# EAGLE schematic ECE319K_Baseline_Schematic (EAGLE 9.6.2)
Spring 2022 EE319K/EE319H This is the baseline schematic
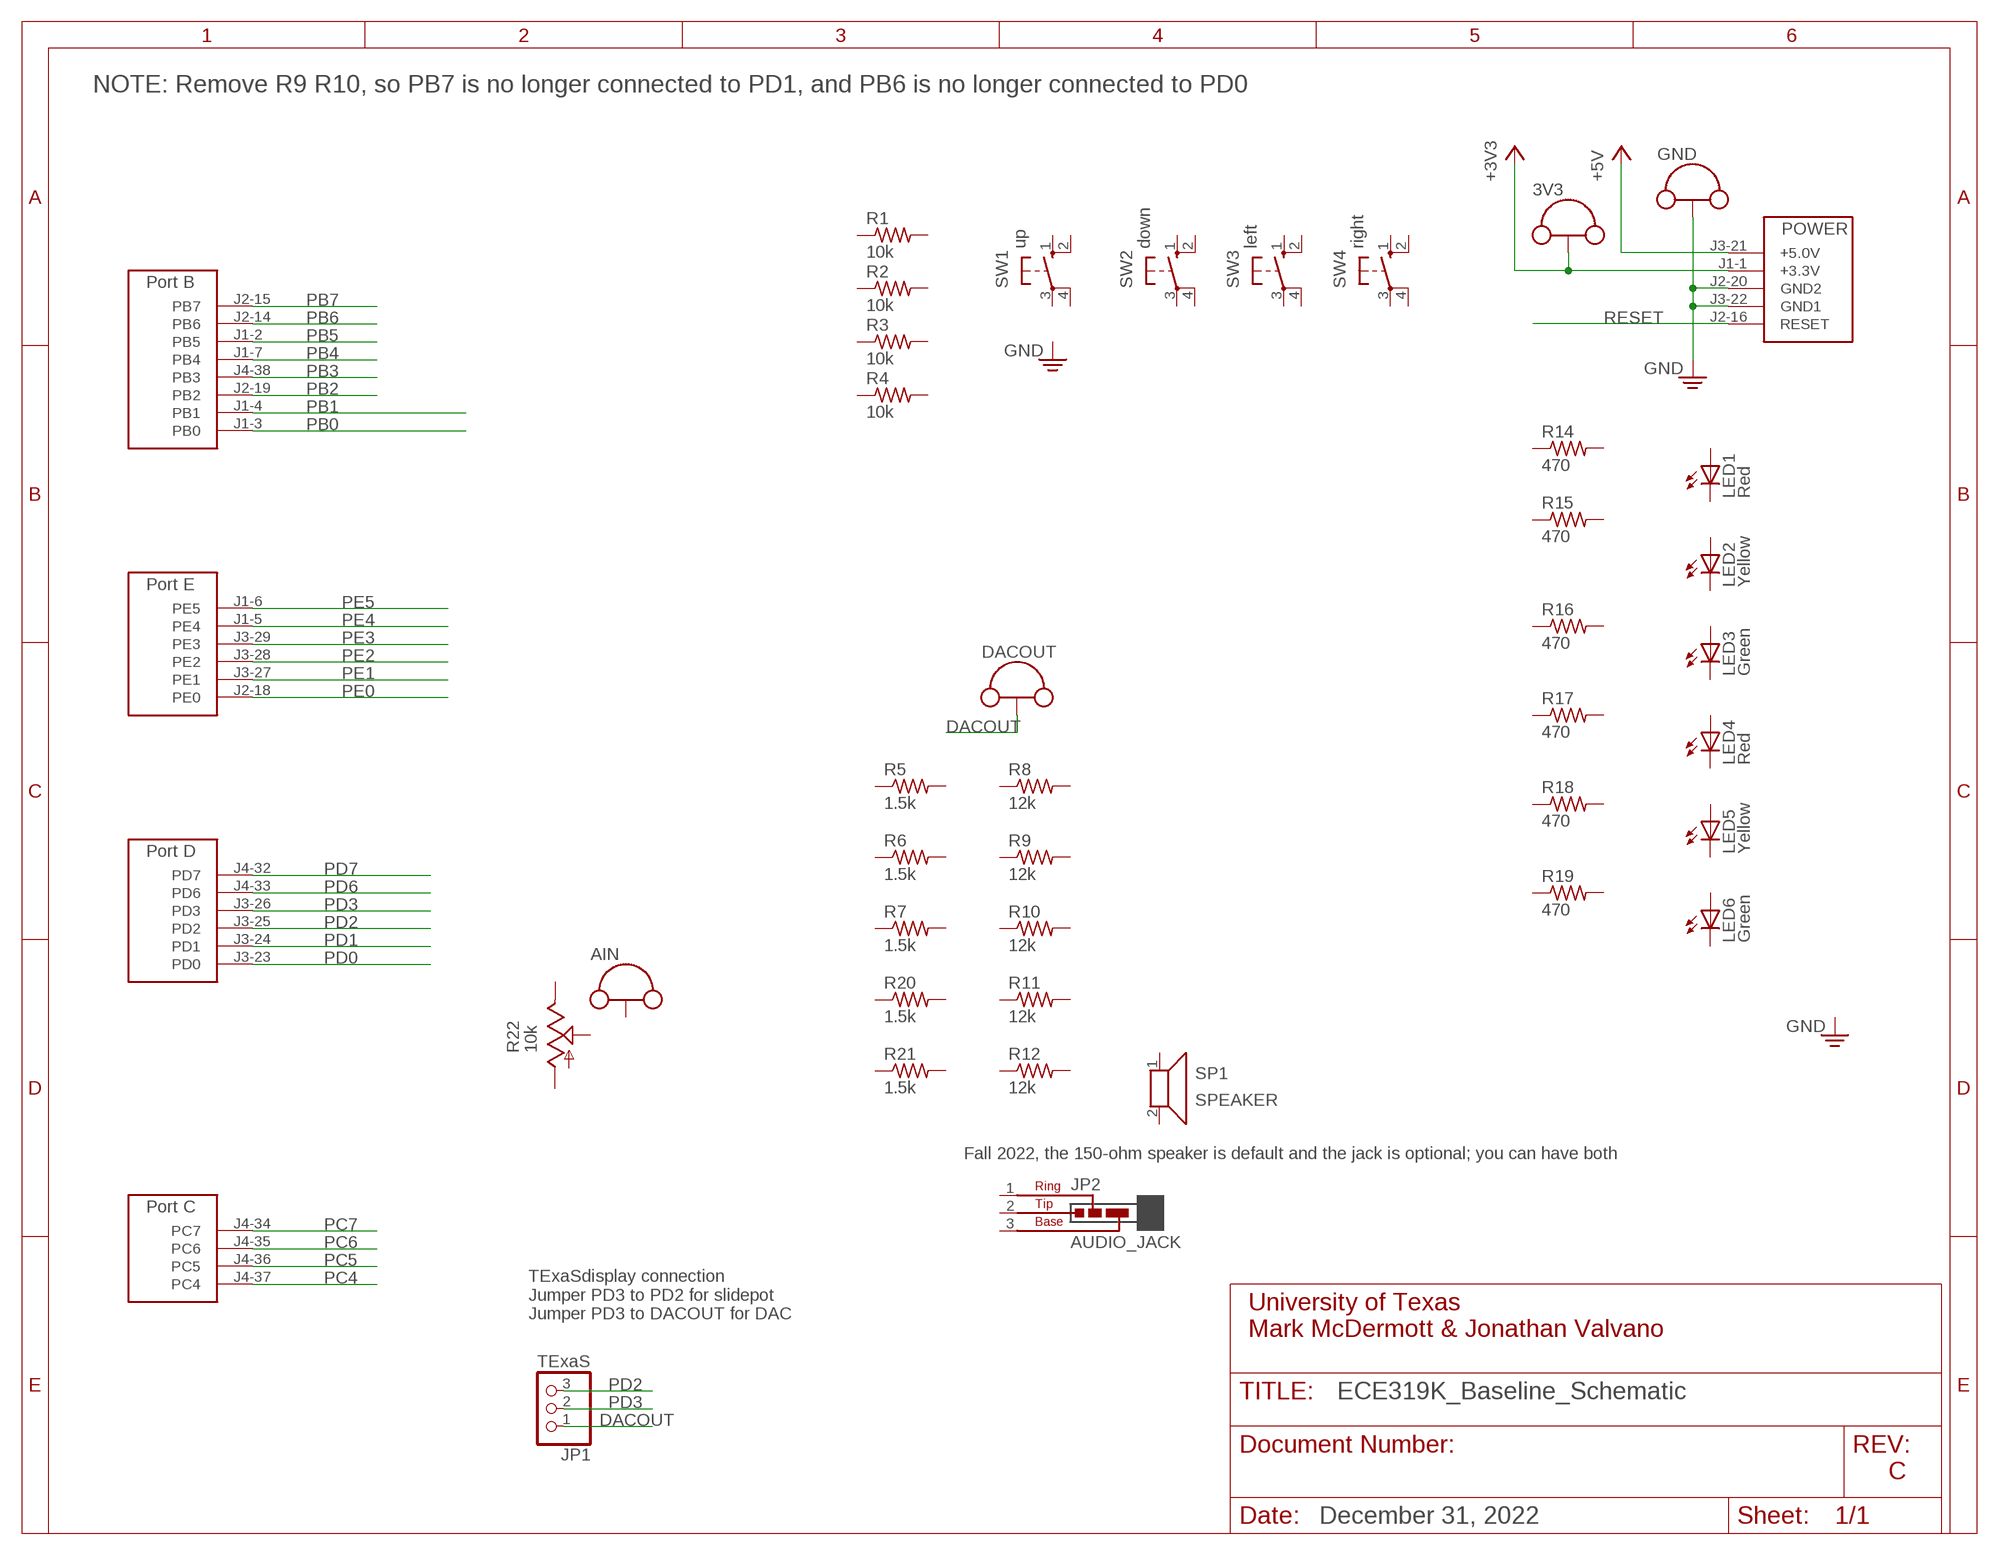
[diagram p0: schematic, sheet 1, part 1 of 2]
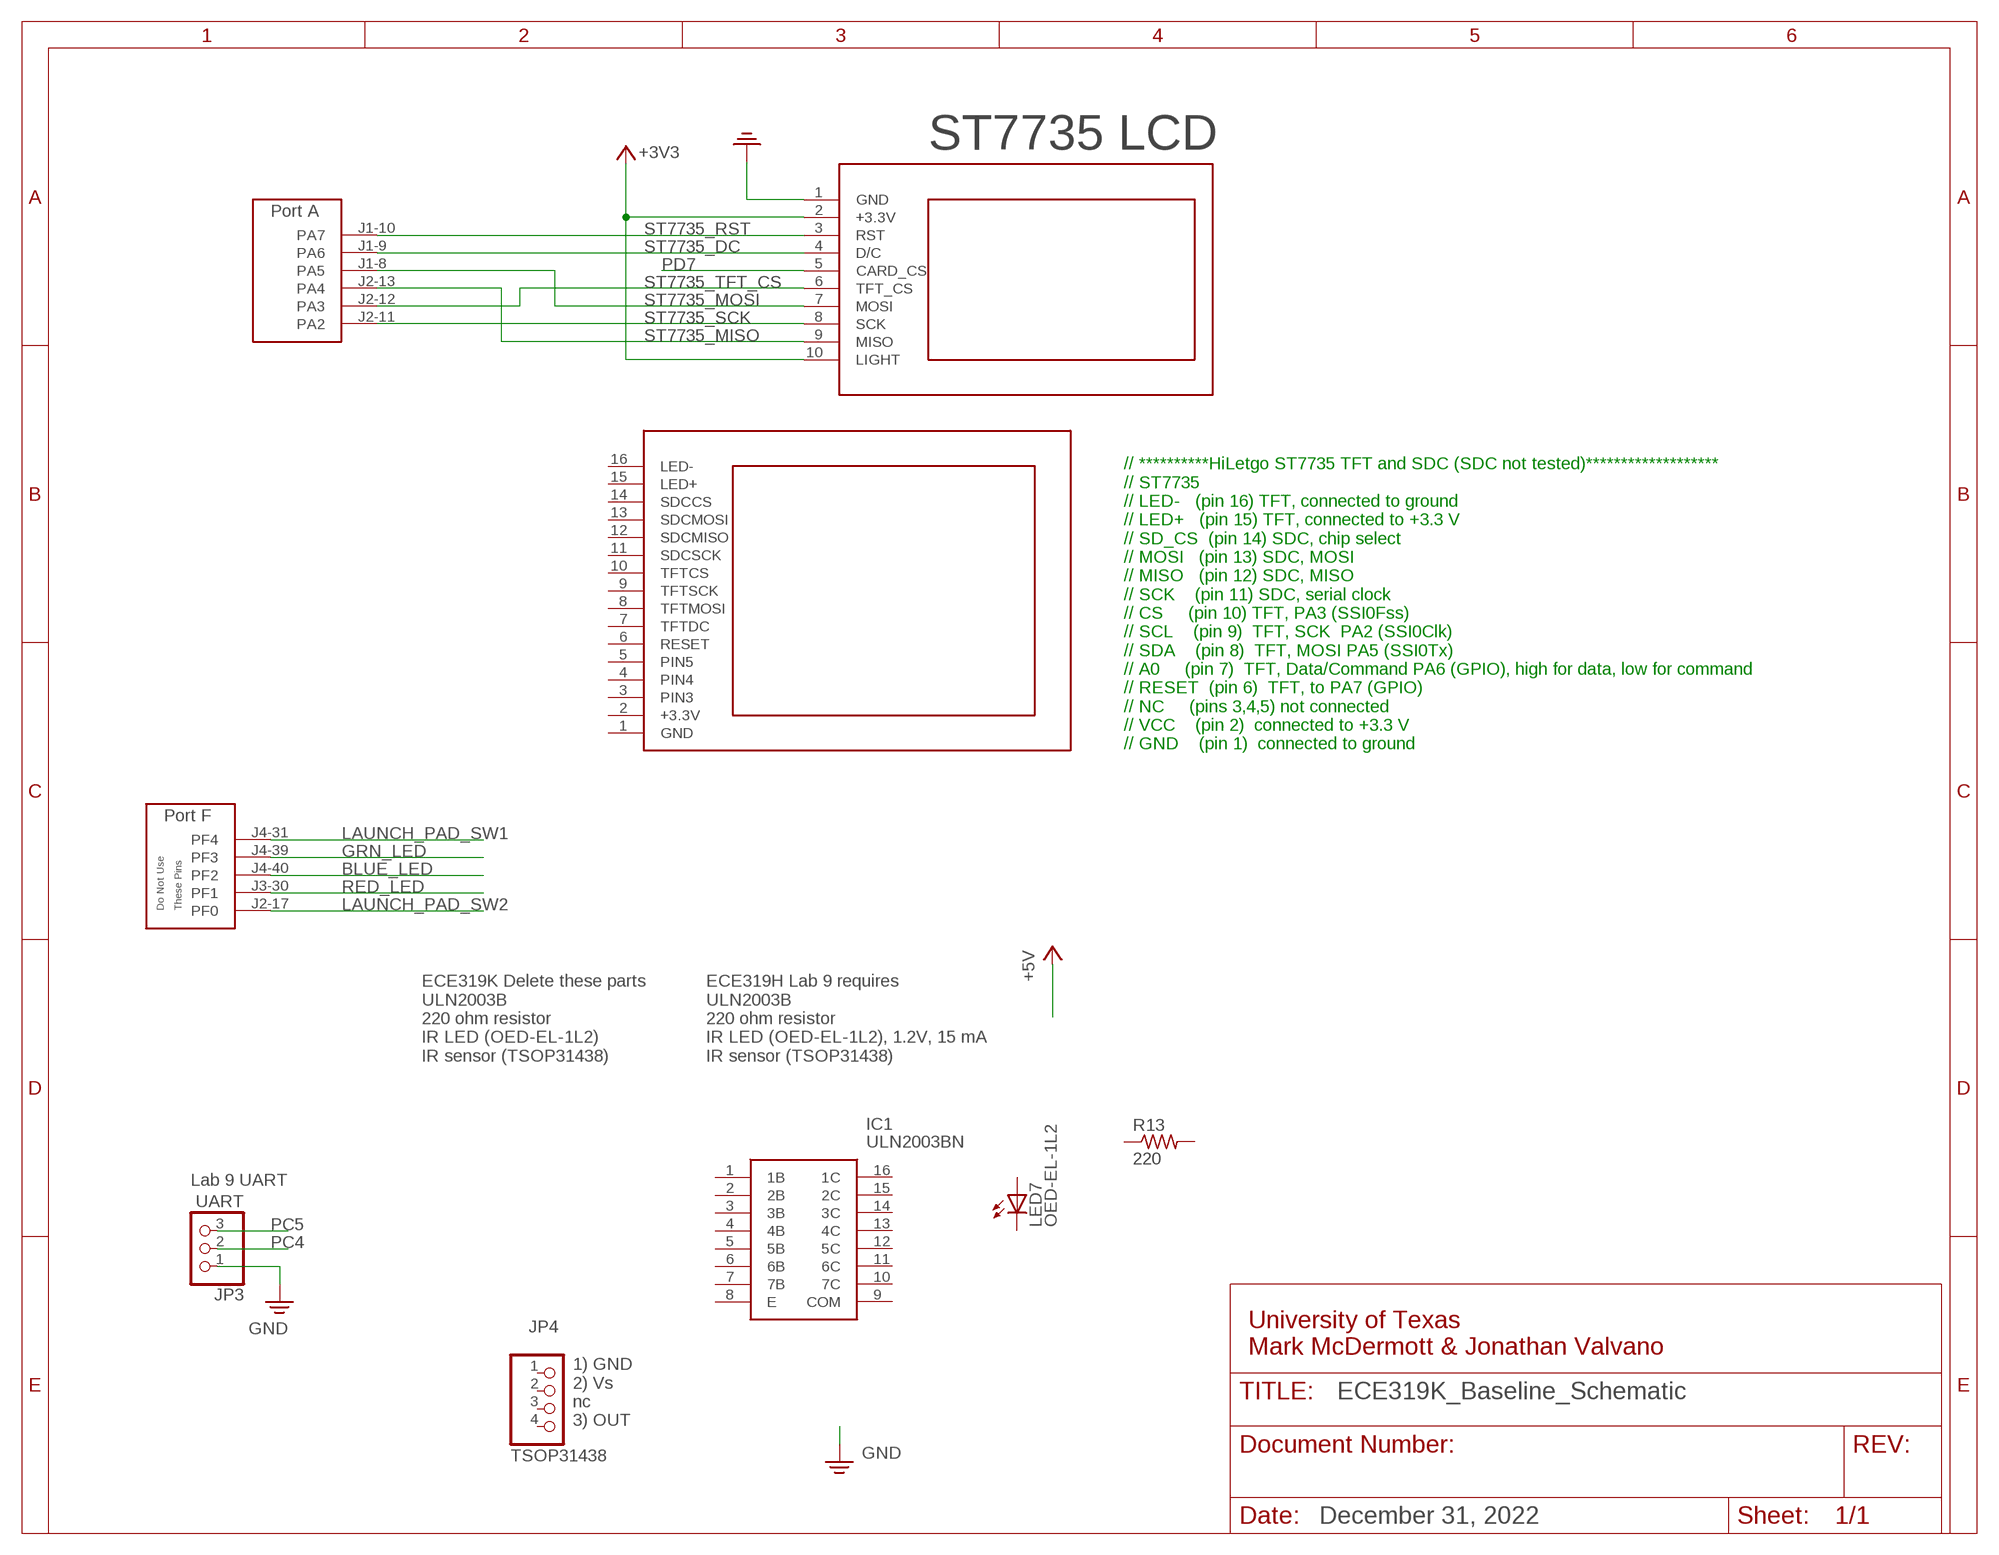
[diagram p1: schematic, sheet 1, part 2 of 2]

## Parts
3V3  TP_LOOP  [TP_LOOP]
AIN  TP_LOOP  [TP_LOOP]
DACOUT  TP_LOOP  [TP_LOOP]
GND  TP_LOOP  [TP_LOOP]
IC1  ULN2003BN  [DIP794W53P254L1930H508Q16N]
JP1  TExaS  PINHD-1X3  [1X03]
JP2  AUDIO_JACK  [JACK]
JP3  UART  PINHD-1X3  [1X03]
JP4  TSOP31438  PINHD-1X4  [1X04]
LED1  Red  LED5MM  [LED5MM]
LED2  Yellow  LED5MM  [LED5MM]
LED3  Green  LED5MM  [LED5MM]
LED4  Red  LED5MM  [LED5MM]
LED5  Yellow  LED5MM  [LED5MM]
LED6  Green  LED5MM  [LED5MM]
LED7  OED-EL-1L2  LED5MM  [LED5MM]
R1  10k  RESISTOR0204/7  [RES300MIL]
R2  10k  RESISTOR0204/7  [RES300MIL]
R3  10k  RESISTOR0204/7  [RES300MIL]
R4  10k  RESISTOR0204/7  [RES300MIL]
R5  1.5k  RESISTOR0204/7  [RES300MIL]
R6  1.5k  RESISTOR0204/7  [RES300MIL]
R7  1.5k  RESISTOR0204/7  [RES300MIL]
R8  12k  RESISTOR0204/7  [RES300MIL]
R9  12k  RESISTOR0204/7  [RES300MIL]
R10  12k  RESISTOR0204/7  [RES300MIL]
R11  12k  RESISTOR0204/7  [RES300MIL]
R12  12k  RESISTOR0204/7  [RES300MIL]
R13  220  RESISTOR0204/7  [RES300MIL]
R14  470  RESISTOR0204/7  [RES300MIL]
R15  470  RESISTOR0204/7  [RES300MIL]
R16  470  RESISTOR0204/7  [RES300MIL]
R17  470  RESISTOR0204/7  [RES300MIL]
R18  470  RESISTOR0204/7  [RES300MIL]
R19  470  RESISTOR0204/7  [RES300MIL]
R20  1.5k  RESISTOR0204/7  [RES300MIL]
R21  1.5k  RESISTOR0204/7  [RES300MIL]
R22  10k  POTENTIOMETER_PTA2043B25U  [PTA2043]
SP1  SPEAKER  [1X02]
SW1  up  B3F-1052  [B3F-10XX]
SW2  down  B3F-1052  [B3F-10XX]
SW3  left  B3F-1052  [B3F-10XX]
SW4  right  B3F-1052  [B3F-10XX]
U$1  HILETGO  [HILETGO]
U$2  TM4C_BP  [TM4C_BOOSTER_PACK]
U$3  ST7735  [ST7735]

## Nets
+3V3: 3V3.P$1(TP) 3V3.P$2(TP) U$2.J1-1(+3.3V) U$3.2(+3.3V) U$3.10(LIGHT)
+5V: U$2.J3-21(+5.0V)
BLUE_LED: U$2.J4-40(PF2)
DACOUT: DACOUT.P$1(TP) DACOUT.P$2(TP) JP1.1
GND: GND.P$1(TP) GND.P$2(TP) JP3.1 U$2.J2-20(GND2) U$2.J3-22(GND1) U$3.1(GND)
GRN_LED: U$2.J4-39(PF3)
LAUNCH_PAD_SW1: U$2.J4-31(PF4)
LAUNCH_PAD_SW2: U$2.J2-17(PF0)
PB0: U$2.J1-3(PB0)
PB1: U$2.J1-4(PB1)
PB2: U$2.J2-19(PB2)
PB3: U$2.J4-38(PB3)
PB4: U$2.J1-7(PB4)
PB5: U$2.J1-2(PB5)
PB6: U$2.J2-14(PB6)
PB7: U$2.J2-15(PB7)
PC4: JP3.2 U$2.J4-37(PC4)
PC5: JP3.3 U$2.J4-36(PC5)
PC6: U$2.J4-35(PC6)
PC7: U$2.J4-34(PC7)
PD0: U$2.J3-23(PD0)
PD1: U$2.J3-24(PD1)
PD2: JP1.3 U$2.J3-25(PD2)
PD3: JP1.2 U$2.J3-26(PD3)
PD6: U$2.J4-33(PD6)
PD7: U$2.J4-32(PD7) U$3.5(CARD_CS)
PE0: U$2.J2-18(PE0)
PE1: U$2.J3-27(PE1)
PE2: U$2.J3-28(PE2)
PE3: U$2.J3-29(PE3)
PE4: U$2.J1-5(PE4)
PE5: U$2.J1-6(PE5)
RED_LED: U$2.J3-30(PF1)
RESET: U$2.J2-16(RESET)
ST7735_DC: U$2.J1-9(PA6) U$3.4(D/C)
ST7735_MISO: U$2.J2-13(PA4) U$3.9(MISO)
ST7735_MOSI: U$2.J1-8(PA5) U$3.7(MOSI)
ST7735_RST: U$2.J1-10(PA7) U$3.3(RST)
ST7735_SCK: U$2.J2-11(PA2) U$3.8(SCK)
ST7735_TFT_CS: U$2.J2-12(PA3) U$3.6(TFT_CS)
Unconnected: AIN.P$1(TP) AIN.P$2(TP) IC1.1(1B) IC1.2(2B) IC1.3(3B) IC1.4(4B) IC1.5(5B) IC1.6(6B) IC1.7(7B) IC1.8(E) IC1.9(COM) IC1.10(7C) IC1.11(6C) IC1.12(5C) IC1.13(4C) IC1.14(3C) IC1.15(2C) IC1.16(1C) JP2.1(RING) JP2.2(TIP) JP2.3(BASE) JP4.1 JP4.2 JP4.3 JP4.4 LED1.A LED1.K(C) LED2.A LED2.K(C) LED3.A LED3.K(C) LED4.A LED4.K(C) LED5.A LED5.K(C) LED6.A LED6.K(C) LED7.A LED7.K(C) R1.1 R1.2 R2.1 R2.2 R3.1 R3.2 R4.1 R4.2 R5.1 R5.2 R6.1 R6.2 R7.1 R7.2 R8.1 R8.2 R9.1 R9.2 R10.1 R10.2 R11.1 R11.2 R12.1 R12.2 R13.1 R13.2 R14.1 R14.2 R15.1 R15.2 R16.1 R16.2 R17.1 R17.2 R18.1 R18.2 R19.1 R19.2 R20.1 R20.2 R21.1 R21.2 R22.1(E) R22.2(S) R22.3(A) SP1.1 SP1.2 SW1.1(S) SW1.2(S1) SW1.3(P) SW1.4(P1) SW2.1(S) SW2.2(S1) SW2.3(P) SW2.4(P1) SW3.1(S) SW3.2(S1) SW3.3(P) SW3.4(P1) SW4.1(S) SW4.2(S1) SW4.3(P) SW4.4(P1) U$1.1(GND) U$1.2(+3.3V) U$1.3(PIN3) U$1.4(PIN4) U$1.5(PIN5) U$1.6(RESET) U$1.7(TFTDC) U$1.8(TFTMOSI) U$1.9(TFTSCK) U$1.10(TFTCS) U$1.11(SDCSCK) U$1.12(SDCMISO) U$1.13(SDCMOSI) U$1.14(SDCCS) U$1.15(LED+) U$1.16(LED-)

## Notes on the sheet
- NOTE: Remove R9 R10, so PB7 is no longer connected to PD1, and PB6 is no longer connected to PD0
- ST7735 LCD
- // **********HiLetgo ST7735 TFT and SDC (SDC not tested)*******************
  // ST7735
  // LED-   (pin 16) TFT, connected to ground
  // LED+   (pin 15) TFT, connected to +3.3 V
  // SD_CS  (pin 14) SDC, chip select
  // MOSI   (pin 13) SDC, MOSI
  // MISO   (pin 12) SDC, MISO
  // SCK    (pin 11) SDC, serial clock
  // CS     (pin 10) TFT, PA3 (SSI0Fss)
  // SCL    (pin 9)  TFT, SCK  PA2 (SSI0Clk)
  // SDA    (pin 8)  TFT, MOSI PA5 (SSI0Tx)
  // A0     (pin 7)  TFT, Data/Command PA6 (GPIO), high for data, low for command
  // RESET  (pin 6)  TFT, to PA7 (GPIO)
  // NC     (pins 3,4,5) not connected
  // VCC    (pin 2)  connected to +3.3 V
  // GND    (pin 1)  connected to ground
- ECE319K Delete these parts
  ULN2003B
  220 ohm resistor
  IR LED (OED-EL-1L2)
  IR sensor (TSOP31438)
- ECE319H Lab 9 requires
  ULN2003B
  220 ohm resistor
  IR LED (OED-EL-1L2), 1.2V, 15 mA
  IR sensor (TSOP31438)
- Fall 2022, the 150-ohm speaker is default and the jack is optional; you can have both
- Lab 9 UART
- TExaSdisplay connection
  Jumper PD3 to PD2 for slidepot
  Jumper PD3 to DACOUT for DAC
- University of Texas
  Mark McDermott & Jonathan Valvano
- University of Texas
  Mark McDermott & Jonathan Valvano
- 1) GND
  2) Vs
  nc
  3) OUT
- C
- December 31, 2022 | December 31, 2022

## Library data of the parts
3V3 AIN DACOUT GND = EE445L:TP_LOOP
IC1 = ULN2003BN:ULN2003BN: High-voltage High-current Darlington Transistor Array Source: Datasheet <http://www.ti.com/lit/gpn/uln2003b>; DESCRIPTION: High-voltage High-current Darlington Transistor Array; HEIGHT: 5.08mm; MANUFACTURER_NAME: Texas Instruments; MANUFACTURER_PART_NUMBER: ULN2003BN; MOUSER2_PART_NUMBER: 595-ULN2003BN; MOUSER2_PRICE-STOCK: https://www.mouser.com/Search/Refine.aspx?Keyword=595-ULN2003BN
JP1 JP3 = EE445L:PINHD-1X3: PIN HEADER
JP2 = EE445L:AUDIO_JACK: Audio Jack Stereo Jack 3pin 3.5mm, CUI, SJ1-3553NG, CP1-3553NG-ND; OC_FARNELL: unknown; OC_NEWARK: unknown
JP4 = EE445L:PINHD-1X4: PIN HEADER
LED1-LED7 = EE445L:LED: Avago Technologies LED Green 2mA 5mm diffused, HLMP-4740, Digikey 516-1327-ND Red 1.6V 1mA 5mm diffused, HLMP-D150, Digikey 516-1323-ND Yellow 2mA 5mm diffused, HLMP-4719, Digikey 516-1326-ND Orange 10mA 5mm diffused HLMP-D401, Digikey 516-1330-ND Blue 10mA 5mm diffused
R1-R21 = EE445L:RESISTOR: RESISTOR, American symbol
R22 = EE445L:POTENTIOMETER_PTA2043: POTENTIOMETER Warning There are many many sizes and shapes of potentiometers. Please verify both the wiring and the physical layout of your pots.
SP1 = EE445L:SPEAKER: Speaker Connected off PCB with two wires. 32-ohm speaker, AllElectronics, SK-230, http://www.allelectronics.com/make-a-store/item/sk-230/20-mm-32-ohm-speaker/1.html
SW1-SW4 = EE445L:B3F-1052: OMRON SWITCH 1.1mm holes; MPN: B3F-1000; OC_FARNELL: 176432; OC_NEWARK: 36M3542
U$1 = EE445L:HILETGO: HiLetgo ST7735 TFT and SDC // GND (pin 1) connected to ground // VCC (pin 2) connected to +3.3 V // NC (pins 3,4,5) not connected // RESET (pin 6) TFT, to PA7 (GPIO) // A0 (pin 7) TFT, Data/Command PA6 (GPIO), high for data, low for command // SDA (pin 8) TFT, MOSI PA5 (SSI0Tx) // SCL (pin 9) TFT, SCK PA2 (SSI0Clk) // CS (pin 10) TFT, PA3 (SSI0Fss) // SCK (pin 11) SDC, serial clock, also connect to PA2 ST7735_SCK // MISO (pin 12) SDC, MISO, connect to PA4 ST7735_MISO // MOSI (pin 13) SDC, MOSI, also connect to ST7735_MOSI PA5 // SD_CS (pin 14) SDC, chip select, connect to PD7 // LED+ (pin 15) TFT, connected to +3.3 V // LED- (pin 16) TFT, connected to ground
U$2 = EE445L:TM4C_BP
U$3 = EE445L:ST7735